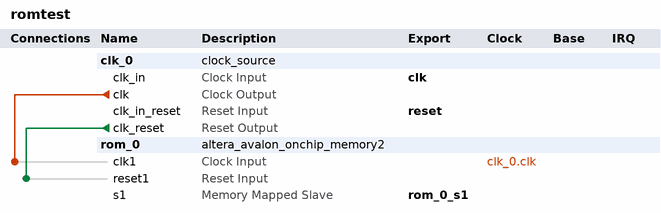
[diagram p0: system contents]
# Platform Designer (Qsys) system romtest, Cyclone II EP2C20F484C7
# Parameters at their usual value, and those the tool derives, are not listed.
package require -exact qsys 13.0
create_system romtest
set_project_property DEVICE_FAMILY {Cyclone II}
set_project_property DEVICE EP2C20F484C7

add_instance clk_0 clock_source 13.0
set_instance_parameter_value clk_0 clockFrequency 24000000

add_instance rom_0 altera_avalon_onchip_memory2 13.0.1.99.2
set_instance_parameter_value rom_0 allowInSystemMemoryContentEditor true
set_instance_parameter_value rom_0 dataWidth 8
set_instance_parameter_value rom_0 dualPort false
set_instance_parameter_value rom_0 initMemContent true
set_instance_parameter_value rom_0 initializationFileName onchip_mem.hex
set_instance_parameter_value rom_0 instanceID TEST
set_instance_parameter_value rom_0 memorySize 256
set_instance_parameter_value rom_0 writable false

# connections
add_connection clk_0.clk rom_0.clk1 clock
add_connection clk_0.clk_reset rom_0.reset1 reset

# exported interfaces
add_interface clk clock sink
set_interface_property clk EXPORT_OF clk_0.clk_in
add_interface reset reset sink
set_interface_property reset EXPORT_OF clk_0.clk_in_reset
add_interface rom_0_s1 avalon slave
set_interface_property rom_0_s1 EXPORT_OF rom_0.s1

set_interconnect_requirement {$system} qsys_mm.clockCrossingAdapter HANDSHAKE
set_interconnect_requirement {$system} qsys_mm.maxAdditionalLatency 1

save_system romtest.qsys
